# EAGLE design Viisilukk (EAGLE 9.1.3)
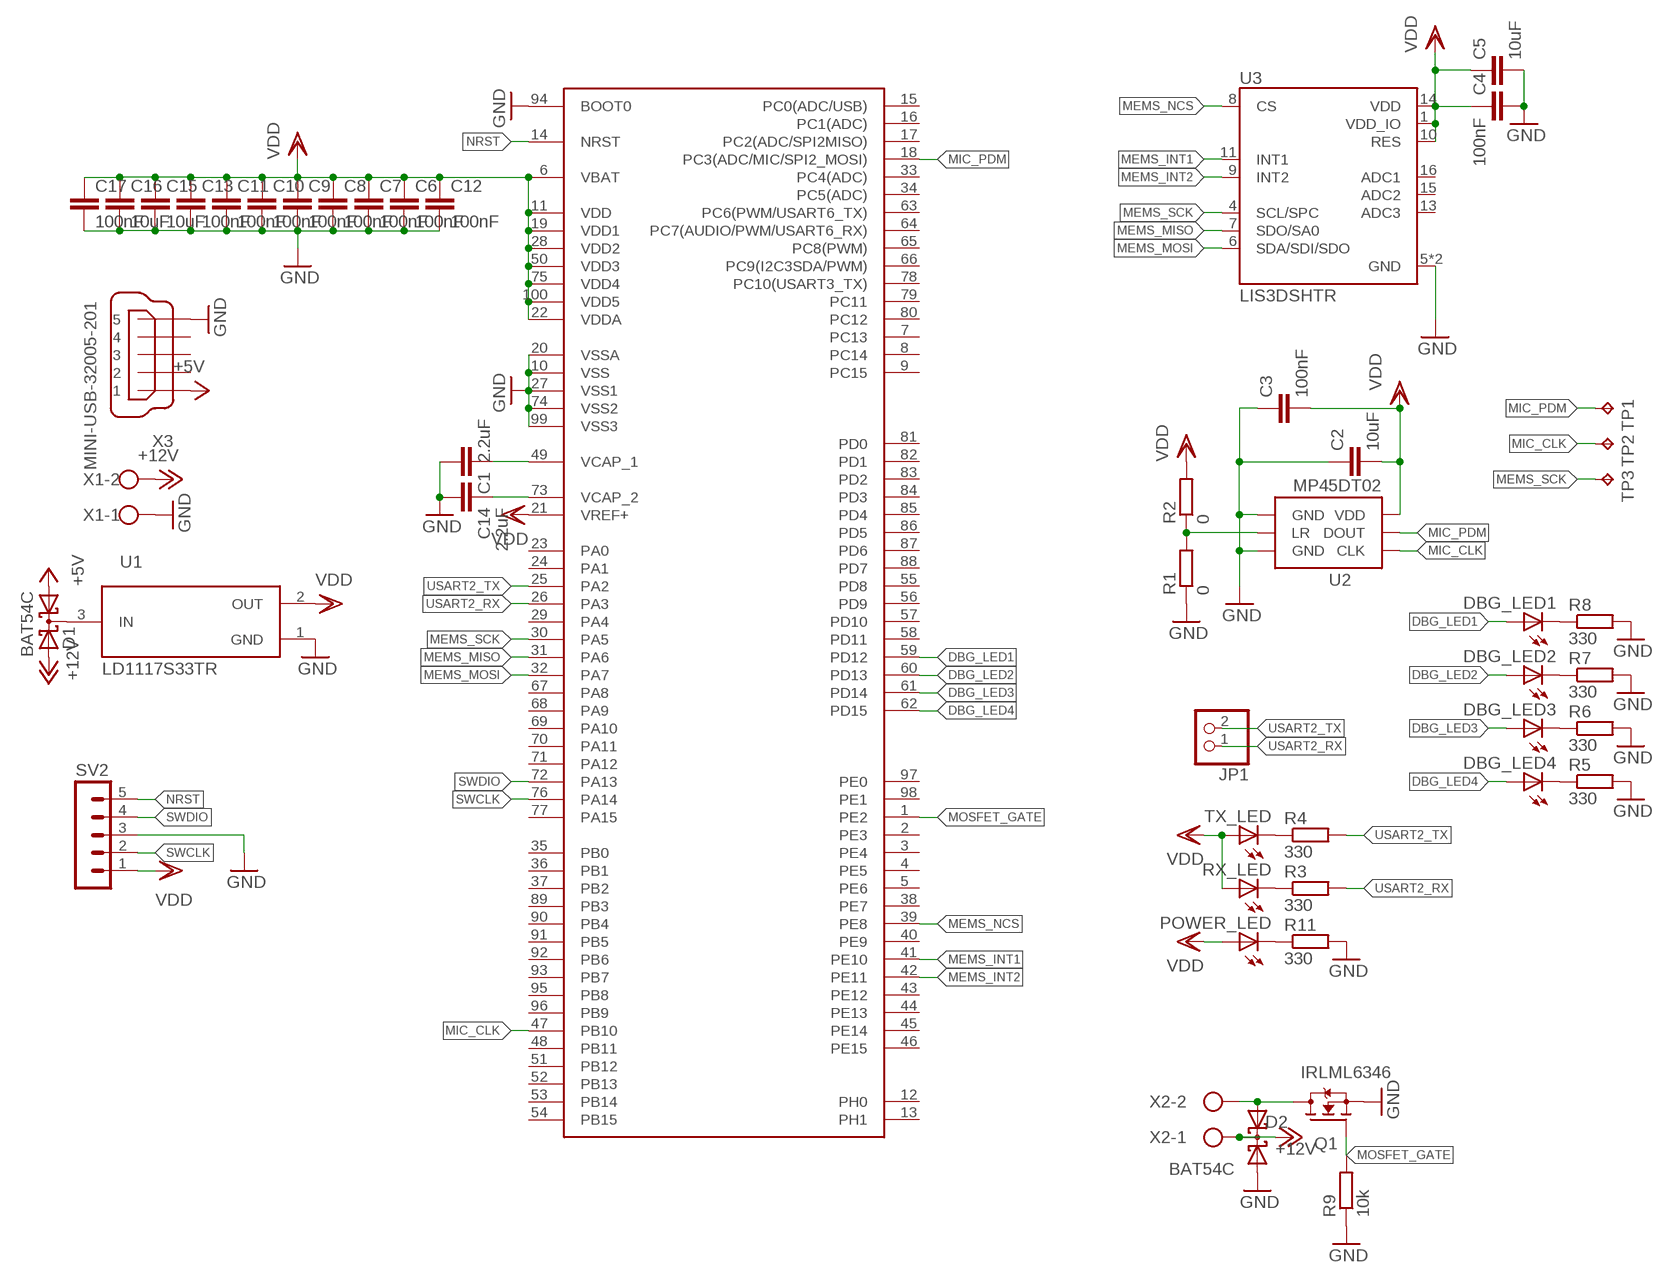
[diagram p0: schematic, sheet 1]

## Parts
C1  2.2uF  C-EUC0603  [C0603]
C2  10uF  C-EUC0805  [C0805]
C3  100nF  C-EUC0603  [C0603]
C4  100nF  C-EUC0603  [C0603]
C5  10uF  C-EUC0805  [C0805]
C6  100nF  C-EUC0603  [C0603]
C7  100nF  C-EUC0603  [C0603]
C8  100nF  C-EUC0603  [C0603]
C9  100nF  C-EUC0603  [C0603]
C10  100nF  C-EUC0603  [C0603]
C11  100nF  C-EUC0603  [C0603]
C12  100nF  C-EUC0603  [C0603]
C13  100nF  C-EUC0603  [C0603]
C14  2.2uF  C-EUC0603  [C0603]
C15  10uF  C-EUC0805  [C0805]
C16  10uF  C-EUC0805  [C0805]
C17  100nF  C-EUC0603  [C0603]
D1  BAT54C  [SOT23]
D2  BAT54C  [SOT23]
DBG_LED1  LEDCHIP-LED0603  [CHIP-LED0603]
DBG_LED2  LEDCHIP-LED0603  [CHIP-LED0603]
DBG_LED3  LEDCHIP-LED0603  [CHIP-LED0603]
DBG_LED4  LEDCHIP-LED0603  [CHIP-LED0603]
JP1  PINHD-1X2  [1X02]
POWER_LED  LEDCHIP-LED0603  [CHIP-LED0603]
Q1  IRLML6346  [SOT23]
R1  0  R-EU_R0603  [R0603]
R2  0  R-EU_R0603  [R0603]
R3  330  R-EU_R0603  [R0603]
R4  330  R-EU_R0603  [R0603]
R5  330  R-EU_R0603  [R0603]
R6  330  R-EU_R0603  [R0603]
R7  330  R-EU_R0603  [R0603]
R8  330  R-EU_R0603  [R0603]
R9  10k  R-EU_R0603  [R0603]
R11  330  R-EU_R0603  [R0603]
RX_LED  LEDCHIP-LED0603  [CHIP-LED0603]
SV2  MA05-1  [MA05-1]
TP1  TPB2,54  [B2,54]
TP2  TPB2,54  [B2,54]
TP3  TPB2,54  [B2,54]
TX_LED  LEDCHIP-LED0603  [CHIP-LED0603]
U1  LD1117S33TR  [SOT230P700X180-4N]
U2  MP45DT02  [ST_HLGA6]
U3  LIS3DSHTR  [LGA16R50P5X3_300X300X100N]
U$1  STM32F407STM32D40X  [LQFP100]
X1  W237-102  [W237-102]
X2  W237-102  [W237-102]
X3  MINI-USB-32005-201  [32005-201]

## Nets
+5V: D1.1(A1) X3.1
+12V: D1.2(A2) D2.3(CC) X1.2 X2.1
DBG_LED1: DBG_LED1.A U$1.59(PD12)
DBG_LED2: DBG_LED2.A U$1.60(PD13)
DBG_LED3: DBG_LED3.A U$1.61(PD14)
DBG_LED4: DBG_LED4.A U$1.62(PD15)
GND: C1.2 C2.1 C3.1 C4.2 C5.2 C6.2 C7.2 C8.2 C9.2 C10.2 C11.2 C12.2 C13.2 C14.2 C15.2 C16.2 C17.2 D2.1(A1) Q1.2(S) R1.1 R5.2 R6.2 R7.2 R8.2 R9.1 R11.2 SV2.3 U1.1(GND) U2.1(GND) U2.3(GND) U3.5(GND) U3.12(GND) U$1.10(VSS) U$1.20(VSSA) U$1.27(VSS1) U$1.74(VSS2) U$1.94(BOOT0) U$1.99(VSS3) X1.1 X3.5
MEMS_INT1: U3.11(INT1) U$1.41(PE10)
MEMS_INT2: U3.9(INT2) U$1.42(PE11)
MEMS_MISO: U3.7(SDO/SA0) U$1.31(PA6)
MEMS_MOSI: U3.6(SDA/SDI/SDO) U$1.32(PA7)
MEMS_NCS: U3.8(CS) U$1.39(PE8)
MEMS_SCK: TP3.TP U3.4(SCL/SPC) U$1.30(PA5)
MIC_CLK: TP2.TP U2.4(CLK) U$1.47(PB10)
MIC_PDM: TP1.TP U2.5(DOUT) U$1.18(PC3(ADC/MIC/SPI2_MOSI))
MOSFET_GATE: Q1.1(G) R9.2 U$1.1(PE2)
N$1: POWER_LED.C R11.1
N$2: C14.1 U$1.73(VCAP_2)
N$3: R1.2 R2.1 U2.2(LR)
N$4: R3.1 RX_LED.C
N$5: C1.1 U$1.49(VCAP_1)
N$6: D1.3(CC) U1.3(IN)
N$7: R4.1 TX_LED.C
N$9: DBG_LED4.C R5.1
N$10: DBG_LED3.C R6.1
N$11: DBG_LED2.C R7.1
N$12: DBG_LED1.C R8.1
N$13: D2.2(A2) Q1.3(D) X2.2
NRST: SV2.5 U$1.14(NRST)
SWCLK: SV2.2 U$1.76(PA14)
SWDIO: SV2.4 U$1.72(PA13)
USART2_RX: JP1.1 R3.2 U$1.26(PA3)
USART2_TX: JP1.2 R4.2 U$1.25(PA2)
VDD: C2.2 C3.2 C4.1 C5.1 C6.1 C7.1 C8.1 C9.1 C10.1 C11.1 C12.1 C13.1 C15.1 C16.1 C17.1 POWER_LED.A R2.2 RX_LED.A SV2.1 TX_LED.A U1.2(OUT) U2.6(VDD) U3.1(VDD_IO) U3.10(RES) U3.14(VDD) U$1.6(VBAT) U$1.11(VDD) U$1.19(VDD1) U$1.21(VREF+) U$1.22(VDDA) U$1.28(VDD2) U$1.50(VDD3) U$1.75(VDD4) U$1.100(VDD5)
Unconnected: U3.13(ADC3) U3.15(ADC2) U3.16(ADC1) U$1.2(PE3) U$1.3(PE4) U$1.4(PE5) U$1.5(PE6) U$1.7(PC13) U$1.8(PC14) U$1.9(PC15) U$1.12(PH0) U$1.13(PH1) U$1.15(PC0(ADC/USB)) U$1.16(PC1(ADC)) U$1.17(PC2(ADC/SPI2MISO)) U$1.23(PA0) U$1.24(PA1) U$1.29(PA4) U$1.33(PC4(ADC)) U$1.34(PC5(ADC)) U$1.35(PB0) U$1.36(PB1) U$1.37(PB2) U$1.38(PE7) U$1.40(PE9) U$1.43(PE12) U$1.44(PE13) U$1.45(PE14) U$1.46(PE15) U$1.48(PB11) U$1.51(PB12) U$1.52(PB13) U$1.53(PB14) U$1.54(PB15) U$1.55(PD8) U$1.56(PD9) U$1.57(PD10) U$1.58(PD11) U$1.63(PC6(PWM/USART6_TX)) U$1.64(PC7(AUDIO/PWM/USART6_RX)) U$1.65(PC8(PWM)) U$1.66(PC9(I2C3SDA/PWM)) U$1.67(PA8) U$1.68(PA9) U$1.69(PA10) U$1.70(PA11) U$1.71(PA12) U$1.77(PA15) U$1.78(PC10(USART3_TX)) U$1.79(PC11) U$1.80(PC12) U$1.81(PD0) U$1.82(PD1) U$1.83(PD2) U$1.84(PD3) U$1.85(PD4) U$1.86(PD5) U$1.87(PD6) U$1.88(PD7) U$1.89(PB3) U$1.90(PB4) U$1.91(PB5) U$1.92(PB6) U$1.93(PB7) U$1.95(PB8) U$1.96(PB9) U$1.97(PE0) U$1.98(PE1) X3.2 X3.3 X3.4

## Library data of the parts
C1-C17 = resistor:C-EU: CAPACITOR, European symbol
D1 D2 = diode:BAT54C: Schottky Diodes Source: Fairchild .. BAT54.pdf
DBG_LED1-DBG_LED4 POWER_LED RX_LED TX_LED = led:LED: LED OSRAM: - CHIPLED LG R971, LG N971, LY N971, LG Q971, LY Q971, LO R971, LY R971 LH N974, LH R974 LS Q976, LO Q976, LY Q976 LO Q996 - Hyper CHIPLED LW Q18S LB Q993, LB Q99A, LB R99A - SideLED LS A670, LO A670, LY A670, LG A670, LP A670 LB A673, LV A673, LT A673, LW A673 LH A674 LY A675 LS A676, LA A676, LO A676, LY A676, LW A676 LS A679, LY A679, LG A679 - Hyper Micro SIDELED® LS Y876, LA Y876, LO Y876, LY Y876 LT Y87S - SmartLED LW L88C, LW L88S LB L89C, LB L89S, LG L890 LS L89K, LO L89K, LY L89K LS L896, LA L896, LO L896, LY L896 - TOPLED LS T670, LO T670, LY T670, LG T670, LP T670 LSG T670, LSP T670, LSY T670, LOP T670, LYG T670 LG T671, LOG T671, LSG T671 LB T673, LV T673, LT T673, LW T673 LH T674 LS T676, LA T676, LO T676, LY T676, LB T676, LH T676, LSB T676, LW T676 LB T67C, LV T67C, LT T67C, LS T67K, LO T67K, LY T67K, LW E67C LS E67B, LA E67B, LO E67B, LY E67B, LB E67C, LV E67C, LT E67C LW T67C LS T679, LY T679, LG T679 LS T770, LO T770, LY T770, LG T770, LP T770 LB T773, LV T773, LT T773, LW T773 LH T774 LS E675, LA E675, LY E675, LS T675 LS T776, LA T776, LO T776, LY T776, LB T776 LHGB T686 LT T68C, LB T68C - Hyper Mini TOPLED® LB M676 - Mini TOPLED Santana® LG M470 LS M47K, LO M47K, LY M47K Source: http://www.osram.convergy.de LUXEON: - LUMILED® LXK2-PW12-R00, LXK2-PW12-S00, LXK2-PW14-U00, LXK2-PW14-V00 LXK2-PM12-R00, LXK2-PM12-S00, LXK2-PM14-U00 LXK2-PE12-Q00, LXK2-PE12-R00, LXK2-PE12-S00, LXK2-PE14-T00, LXK2-PE14-U00 LXK2-PB12-K00, LXK2-PB12-L00, LXK2-PB12-M00, LXK2-PB14-N00, LXK2-PB14-P00, LXK2-PB14-Q00 LXK2-PR12-L00, LXK2-PR12-M00, LXK2-PR14-Q00, LXK2-PR14-R00 LXK2-PD12-Q00, LXK2-PD12-R00, LXK2-PD12-S00 LXK2-PH12-R00, LXK2-PH12-S00 LXK2-PL12-P00, LXK2-PL12-Q00, LXK2-PL12-R00 Source: www.luxeon.com KINGBRIGHT: KA-3528ASYC Source: www.kingbright.com
JP1 = pinhead:PINHD-1X2: PIN HEADER
Q1 = bss138_10:IRLML6346: BSS138 N-Channel Logic Level Enhancement Mode Field Effect Transistor Source: http://www.fairchildsemi.com/datasheets/BS/BSS138.pdf; MF: Fairchild; MPN: BSS138; OC_FARNELL: 9845330; OC_NEWARK: 67R2009
R1-R9 R11 = resistor:R-EU_: RESISTOR, European symbol
SV2 = con-lstb:MA05-1: PIN HEADER; OC_FARNELL: unknown; OC_NEWARK: unknown
TP1-TP3 = testpad:TP: Test pad
U1 = LD1117S33TR:LD1117S33TR: LDO Voltage Regulators 3.3V 0.8A Positive; AVAILABILITY: Unavailable; DESCRIPTION: LD1117 Series 1300 mA 3.3 V Fixed Output Positive Voltage LDO Regulator- SOT-223; MF: STMicroelectronics; MP: LD1117S33TR; PACKAGE: SOT-223 STMicroelectronics; PRICE: None
U2 = MP45DT02:MP45DT02: Digital MEMS microphone; AVAILABILITY: Unavailable; DESCRIPTION: Mic Omni-Directional -26dB 3.6V Rectangular Solder Pad; MF: STMicroelectronics; MP: MP45DT02; PACKAGE: PDIP-18 STMicroelectronics; PRICE: None
U3 = LIS3DSHTR:LIS3DSHTR: MEMS digital output motion sensor ultra low-power high performance 3-axes "nano" accelerometer; AVAILABILITY: Unavailable; DESCRIPTION: MEMS digital output motion sensor: ultra low-power high performance 3-axes nano accelerometer; MF: STMicroelectronics; MP: LIS3DSHTR; PACKAGE: LGA-16 STMicroelectronics; PRICE: None
U$1 = stm32f:STM32F407: Features • Core: ARM 32-bit Cortex™-M4 CPU with FPU, Adaptive real-time accelerator (ART Accelerator™) allowing 0-wait state execution from Flash memory, frequency up to 168 MHz, memory protection unit, 210 DMIPS/ 1.25 DMIPS/MHz (Dhrystone 2.1), and DSP instructions • Memories – Up to 1 Mbyte of Flash memory – Up to 192+4 Kbytes of SRAM including 64- Kbyte of CCM (core coupled memory) data RAM – Flexible static memory controller supporting Compact Flash, SRAM, PSRAM, NOR and NAND memories • LCD parallel interface, 8080/6800 modes • Clock, reset and supply management – 1.8 V to 3.6 V application supply and I/Os – POR, PDR, PVD and BOR – 4-to-26 MHz crystal oscillator – Internal 16 MHz factory-trimmed RC (1% accuracy) – 32 kHz oscillator for RTC with calibration – Internal 32 kHz RC with calibration • Low power – Sleep, Stop and Standby modes – VBAT supply for RTC, 20×32 bit backup registers + optional 4 KB backup SRAM • 3×12-bit, 2.4 MSPS A/D converters: up to 24 channels and 7.2 MSPS in triple interleaved mode • 2×12-bit D/A converters • General-purpose DMA: 16-stream DMA controller with FIFOs and burst support • Up to 17 timers: up to twelve 16-bit and two 32- bit timers up to 168 MHz, each with up to 4 IC/OC/PWM or pulse counter and quadrature (incremental) encoder input • Debug mode – Serial wire debug (SWD) & JTAG interfaces – Cortex-M4 Embedded Trace Macrocell™ • Up to 140 I/O ports with interrupt capability – Up to 136 fast I/Os up to 84 MHz – Up to 138 5 V-tolerant I/Os • Up to 15 communication interfaces – Up to 3 × I2C interfaces (SMBus/PMBus) – Up to 4 USARTs/2 UARTs (10.5 Mbit/s, ISO 7816 interface, LIN, IrDA, modem control) – Up to 3 SPIs (42 Mbits/s), 2 with muxed full-duplex I2S to achieve audio class accuracy via internal audio PLL or external clock – 2 × CAN interfaces (2.0B Active) – SDIO interface • Advanced connectivity – USB 2.0 full-speed device/host/OTG controller with on-chip PHY – USB 2.0 high-speed/full-speed device/host/OTG controller with dedicated DMA, on-chip full-speed PHY and ULPI – 10/100 Ethernet MAC with dedicated DMA: supports IEEE 1588v2 hardware, MII/RMII • 8- to 14-bit parallel camera interface up to 54 Mbytes/s • True random number generator • CRC calculation unit • 96-bit unique ID • RTC: subsecond accuracy, hardware calendar
X1 X2 = con-wago-500:W237-102: WAGO SCREW CLAMP; MPN: 237-102; OC_FARNELL: unknown; OC_NEWARK: 70K9898
X3 = con-cypressindustries:MINI-USB-: MINI USB-B Conector Source: www.cypressindustries.com; OC_FARNELL: unknown; OC_NEWARK: unknown

## Board
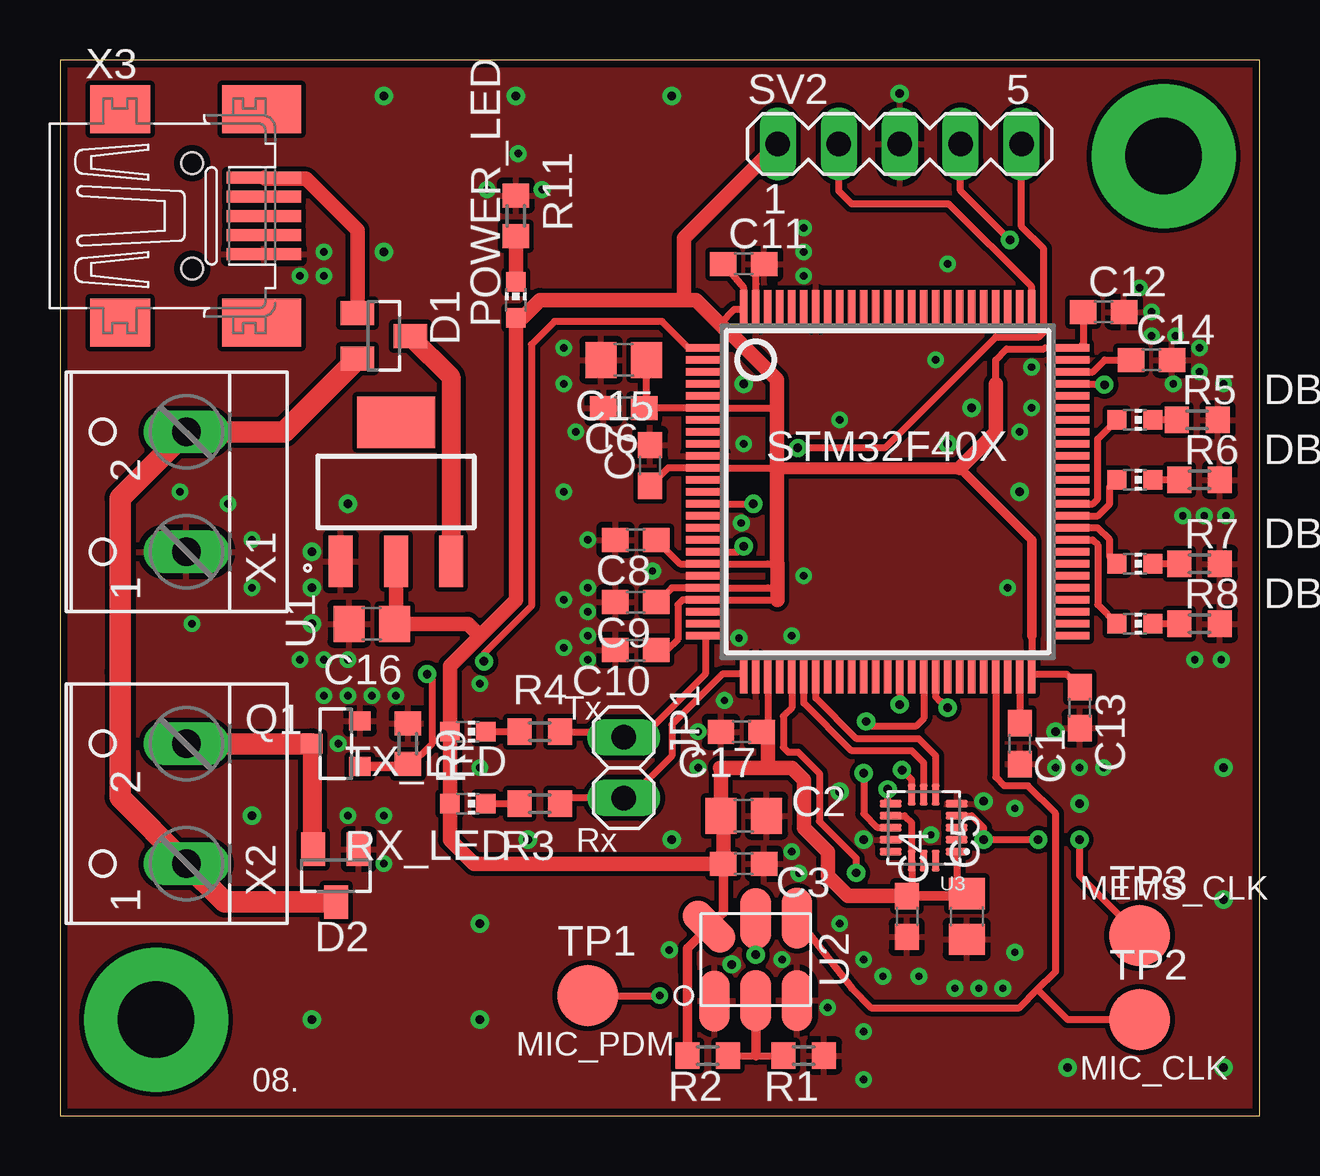
[diagram p1: board, top side]
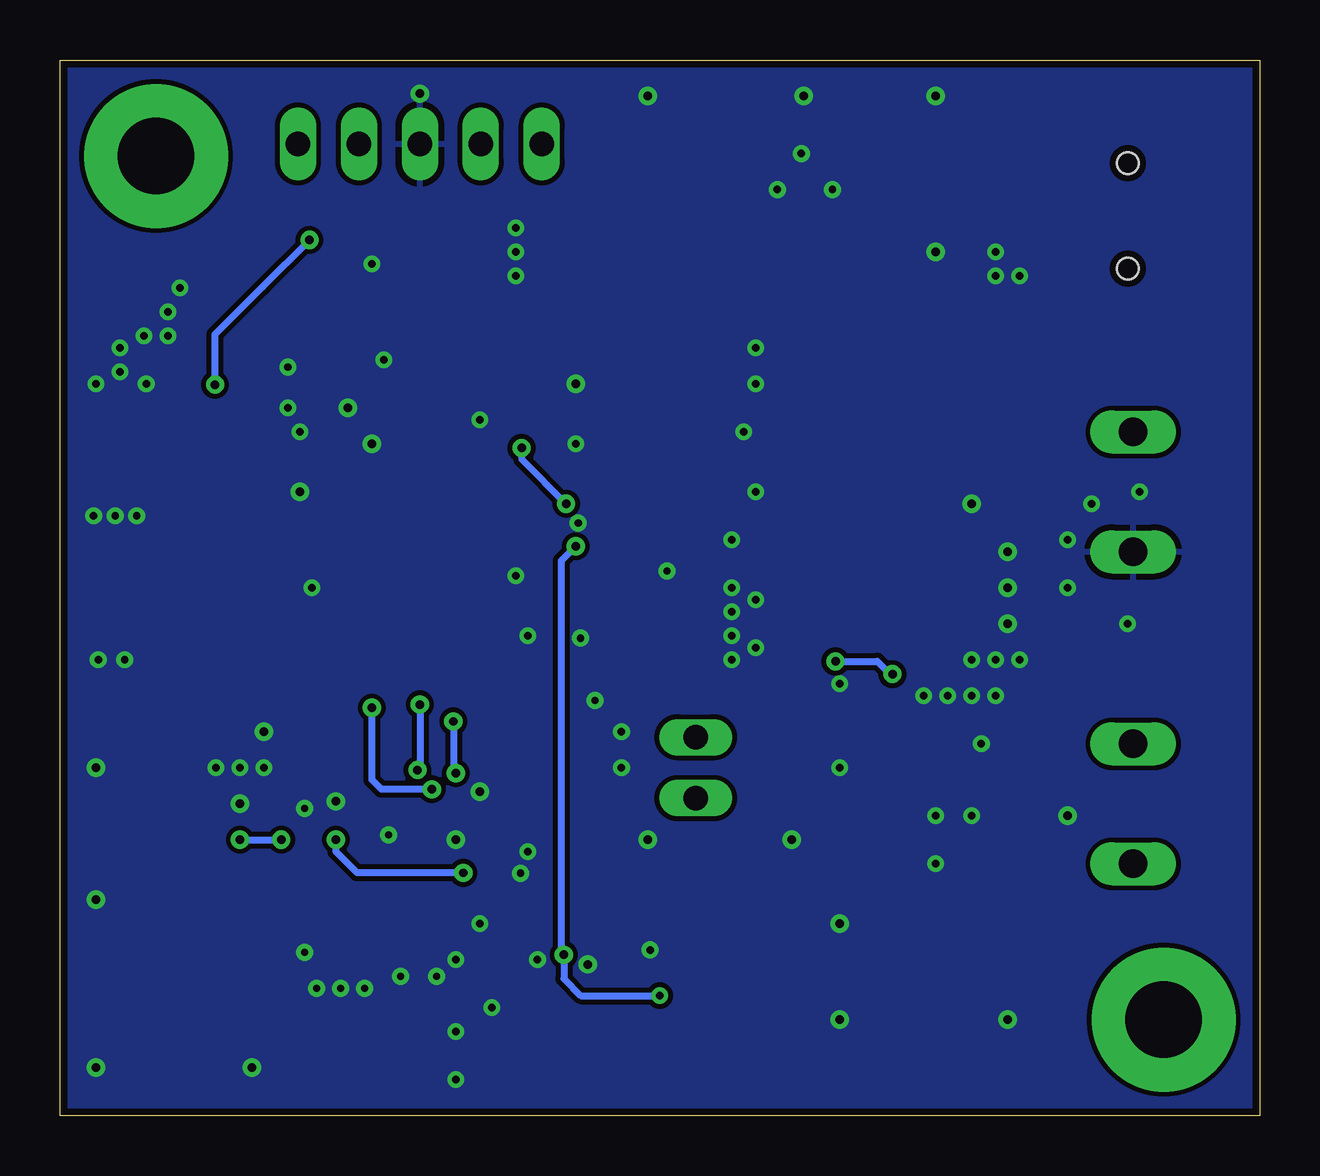
[diagram p2: board, bottom side, seen from below]

Size 50 x 44 mm. Coordinates in mm from the lower left corner, seen from the top.
Outline: 0,0 50,0 50,44 0,44 0,0
Copper layers (1*16): Top 0.035mm / dielectric 1.5mm / Bottom 0.035mm
Design rules "default *": minimum track width 0.2mm, minimum drill 0.3mm, track to track 0.2mm, track to pad 0.2mm, pad to pad 0.2mm, via to via 0.2mm, smd to smd 0mil, copper to edge 0.3mm, drill to drill 6mil, minimum pad ring 10mil, minimum via ring 8mil, stop-mask expansion 4mil, vias tented up to drill 0mil, thermal gap 10mil

### Footprints (pad centres in the part's own frame; a part is rotated, then mirrored left to right if it is on the bottom)
C0603 = smd 1.1 x 1: 1 -0.85,0; 2 0.85,0
C0805 = smd 1.3 x 1.5: 1 -0.95,0; 2 0.95,0
SOT23 = smd 1 x 1.4: 1 -0.95,-1.1; 2 0.95,-1.1; 3 0,1.1
CHIP-LED0603 = smd 0.8 x 0.8: A 0,-0.75; C 0,0.75
1X02 = drill 1.016 long: 1 -1.27,0; 2 1.27,0
SOT23' = smd 0.8 x 0.9: 1 -0.95,-1; 2 0.95,-1; 3 0,1
R0603 = smd 1 x 1.1: 1 -0.85,0; 2 0.85,0
MA05-1 = drill 1.016 long: 1 -5.08,0; 2 -2.54,0; 3 0,0; 4 2.54,0; 5 5.08,0
B2,54 = smd 2.54 x 2.54: TP 0,0
SOT230P700X180-4N = smd 2.15 x 1: 1 -2.9,2.3; 2 -2.9,0; 3 -2.9,-2.3 | smd 2.15 x 3.25: 4 2.9,0
ST_HLGA6 = smd 2.54 x 1.27: 1 -1.727,1.721; 2 -1.708,0; 3 -1.708,-1.727; 4 1.727,-1.721; 5 1.708,0 | smd 2.54 x 1.27 rotated 45: 6 1.373,1.948
LGA16R50P5X3_300X300X100N = smd 0.9 x 0.31: 1 -1.375,1; 2 -1.375,0.5; 3 -1.375,0; 4 -1.375,-0.5; 5 -1.375,-1; 9 1.375,-1; 10 1.375,-0.5; 11 1.375,0; 12 1.375,0.5; 13 1.375,1 | smd 0.31 x 0.9: 6 -0.5,-1.375; 7 0,-1.375; 8 0.5,-1.375; 14 0.5,1.375; 15 0,1.375; 16 -0.5,1.375
LQFP100 = smd 1.6 x 0.3: 1 -7.6,6; 2 -7.6,5.5; 3 -7.6,5; 4 -7.6,4.5; 5 -7.6,4; 6 -7.6,3.5; 7 -7.6,3; 8 -7.6,2.5; 9 -7.6,2; 10 -7.6,1.5; 11 -7.6,1; 12 -7.6,0.5; 13 -7.6,0; 14 -7.6,-0.5; 15 -7.6,-1; 16 -7.6,-1.5; 17 -7.6,-2; 18 -7.6,-2.5; 19 -7.6,-3; 20 -7.6,-3.5; 21 -7.6,-4; 22 -7.6,-4.5; 23 -7.6,-5; 24 -7.6,-5.5; 25 -7.6,-6; 51 7.6,-6; 52 7.6,-5.5; 53 7.6,-5; 54 7.6,-4.5; 55 7.6,-4; 56 7.6,-3.5; 57 7.6,-3; 58 7.6,-2.5; 59 7.6,-2; 60 7.6,-1.5; 61 7.6,-1; 62 7.6,-0.5; 63 7.6,0; 64 7.6,0.5; 65 7.6,1; 66 7.6,1.5; 67 7.6,2; 68 7.6,2.5; 69 7.6,3; 70 7.6,3.5; 71 7.6,4; 72 7.6,4.5; 73 7.6,5; 74 7.6,5.5; 75 7.6,6 | smd 0.3 x 1.6: 26 -6,-7.6; 27 -5.5,-7.6; 28 -5,-7.6; 29 -4.5,-7.6; 30 -4,-7.6; 31 -3.5,-7.6; 32 -3,-7.6; 33 -2.5,-7.6; 34 -2,-7.6; 35 -1.5,-7.6; 36 -1,-7.6; 37 -0.5,-7.6; 38 0,-7.6; 39 0.5,-7.6; 40 1,-7.6; 41 1.5,-7.6; 42 2,-7.6; 43 2.5,-7.6; 44 3,-7.6; 45 3.5,-7.6; 46 4,-7.6; 47 4.5,-7.6; 48 5,-7.6; 49 5.5,-7.6; 50 6,-7.6; 76 6,7.6; 77 5.5,7.6; 78 5,7.6; 79 4.5,7.6; 80 4,7.6; 81 3.5,7.6; 82 3,7.6; 83 2.5,7.6; 84 2,7.6; 85 1.5,7.6; 86 1,7.6; 87 0.5,7.6; 88 0,7.6; 89 -0.5,7.6; 90 -1,7.6; 91 -1.5,7.6; 92 -2,7.6; 93 -2.5,7.6; 94 -3,7.6; 95 -3.5,7.6; 96 -4,7.6; 97 -4.5,7.6; 98 -5,7.6; 99 -5.5,7.6; 100 -6,7.6
W237-102 = drill 1.194 long: 1 -2.5,-1.27; 2 2.5,-1.27
32005-201 = smd 3.1 x 0.5: 1 3,1.6; 2 3,0.8; 3 3,0; 4 3,-0.8; 5 3,-1.6 | smd 2.5 x 2: M1 -3,-4.45; M2 -3,4.45 | smd 3.3 x 2: M3 2.9,4.45; M4 2.9,-4.45 | hole 0.9: 0,2.2; 0,-2.2

### Placement (x,y rotation side)
C1  40,15.5 270 top
C2  28.5,12.5 180 top
C3  28.5,10.5 180 top
C4  35.3,8.3 270 top
C5  37.8,8.3 270 top
C6  23.5,29.5 180 top
C7  24.6,27.1 90 top
C8  24,24 180 top
C9  24,21.4 180 top
C10  24,19.4 180 top
C11  28.5,35.5 0 top
C12  43.5,33.5 0 top
C13  42.5,17 270 top
C14  45.5,31.5 0 top
C15  23.5,31.5 180 top
C16  13,20.5 180 top
C17  28.4,16 180 top
D1  13.5,32.5 270 top
D2  11.5,10 180 top
DBG_LED1  44.8,20.5 270 top
DBG_LED2  44.8,23 270 top
DBG_LED3  44.8,26.5 270 top
DBG_LED4  44.8,29 270 top
JP1  23.5,14.5 90 top
POWER_LED  19,34 0 top
Q1  IRLML6346  [SOT23']  11.5,15.5 90 top
R1  31,2.5 180 top
R2  27,2.5 180 top
R3  20,13 0 top
R4  20,16 0 top
R5  47.4,29 0 top
R6  47.5,26.5 0 top
R7  47.5,23 0 top
R8  47.5,20.5 0 top
R9  14.5,15.5 270 top
R11  19,37.5 90 top
RX_LED  17,13 270 top
SV2  35,40.5 0 top
TP1  22,5 0 top
TP2  45,4 0 top
TP3  45,7.5 0 top
TX_LED  17,16 270 top
U1  14,26 90 top
U2  29,6.5 90 top
U3  36,12 180 top
U$1  34.5,26 0 top
X1  4,26 90 top
X2  4,13 90 top
X3  5.5,37.5 0 top

### Tracks (layer width: path | path; a pad name or v marks a point on that pad's centre or on a via)
+5V
  Top 0.6: X3.1 8.55,39.05 10.26,39.05 12.4,36.91 D1.1
+12V
  Top 0.9: D2.3 6.87,8.9 X2.1 2.5,13.27 2.5,18.5 2.5,25.73 X1.2 9.35,28.5 D1.2
DBG_LED1
  Top 0.3: U$1.59 43.05,24 43.25,23.8 43.25,21.3 DBG_LED1.A
DBG_LED2
  Top 0.3: DBG_LED2.A 43.75,23.3 43.75,24 43.25,24.5 U$1.60
DBG_LED3
  Top 0.3: DBG_LED3.A 43.75,26.2 43.75,25.5 43.25,25 U$1.61
DBG_LED4
  Top 0.3: U$1.62 43.05,25.5 43.25,25.7 43.25,28.2 DBG_LED4.A
GND  (via drill 0.3, 0.35)
  Top 0.3: C11.2 29,35.15 29,34.68 29.02,34.67 29,34.48 U$1.99
  other vias: 11,36 11,35 10,35 10,19 11,19 12,19 14,17.5 13,17.5 12,17.5 11,17.5 11.6,15.5 17.5,18 17.5,14.5 21,19.5 21,26 22,24 24.7,22.7 22,22 22,21 21,21.5 22,20 22,19 28.5,28 25.4,6.9 30.1,6.5 32,4.5 33.5,6.5 33.5,3.5 33.5,1.5 34.3,5.8 35.8,5.8 37.3,5.3 38.3,5.3 39.3,5.3 39.8,6.8 41.5,14.5 42.5,14.5 43.5,14.5 27.7,17.3 26.6,16 26.6,14.5 21,30.5 21,32 21.5,28.5 31,35 31,36 31,37 45,34.5 45.5,33.5 45.5,32.5 46.5,32.5 47.5,32 47.5,31 46.4,30.5 48.4,19 47.3,19 48.6,25 46.8,25 47.7,25 48.5,30.5 12,12.5 13.5,12.5 13.5,10.5 7,25.5 8,24 8,22 5.5,20.5 5,26 17.8,38.6 19.1,40.1 20.1,38.6 36.3,11.7 40.5,31.2 40.5,29.5 40,28.5 39.5,22 28.4,24.7 28.3,19.9 30.5,20 31,22.5 32.5,29 36.5,31.5 39.8,12.8 37,35.5 30.5,11 30.8,10.1 32.5,8 33.5,11.5 38.5,13.1 35,42.6 10.5,22 10.5,23.5 10.5,20.5 41.5,16 42.5,13 10.5,4 17.5,4 42,2 48.5,2 48.5,9 48.5,14.5 25.5,42.5 19,42.5 13.5,42.5 13.5,36 17.5,8 28,6.3 38,29.5 37,28 28.5,30.5 40,26 32.5,13.5 25.5,11.5 19.5,11.5 12,25.5 8,12.5
  pour Top: 0,0 50,0 50,44 0,44
  pour Bottom: 0,44 50,44 50,0 0,0
MEMS_INT1  (via drill 0.35)
  Top 0.3: U$1.41 36,16.55 35.67,16.23 33.8,16.23 v33.6,16.43 | v33.5,14.27 33.5,12.57 34.07,12 U3.11
  Bottom 0.3: v33.6,16.43 33.6,14.37 v33.5,14.27
MEMS_INT2  (via drill 0.35)
  Top 0.3: U3.9 34.5,13.12 v34.5,13.6 | U$1.42 36.5,17.45 36.7,17.25 36.75,17.25 v37,17
  Bottom 0.3: v34.5,13.6 36.6,13.6 37,14 v37,17
MEMS_MISO
  Top 0.3: U3.7 36,14.7 35.5,15.2 32.99,15.2 31,17.19 U$1.31
MEMS_MOSI
  Top 0.3: U3.6 36.5,15 35.8,15.7 33.2,15.7 31.5,17.4 U$1.32
MEMS_NCS  (via drill 0.35)
  Top 0.3: U3.8 35.5,14 v35.1,14.4 | U$1.39 v35,17.13
  Bottom 0.3: v35,17.13 35,14.5 v35.1,14.4
MEMS_SCK  (via drill 0.35)
  Top 0.3: U3.4 38,12.5 38.5,12 v38.5,11.5 v40.77,11.5 | U$1.30 30.5,17 30.15,16.65 30.15,15.35 30.35,15.15 30.77,15.15 31.65,14.27 31.65,12.27 33.19,10.73 v33.19,10.12 | TP3.TP 42.5,10 v42.5,11.5
  Bottom 0.3: v33.19,10.12 37.62,10.12 38.5,11 v38.5,11.5 | v42.5,11.5 v40.77,11.5
MIC_CLK
  Top 0.3: U2.4 33,5.3 33.8,4.5 39.99,4.5 40.75,5.25 | 40.75,5.25 41.5,6.01 41.5,12.59 40.34,13.75 39.35,13.75 39,14.11 U$1.47 | TP2.TP 42,4 40.75,5.25
MIC_PDM  (via drill 0.3, 0.35)
  Top 0.3: U2.5 v29,6.7 | U$1.18 28.27,23.5 v28.5,23.73 | TP1.TP v25,5
  Bottom 0.3: v28.5,23.73 29.1,23.13 29.1,6.8 v29,6.7 29,5.7 28.3,5 v25,5
MOSFET_GATE  (via drill 0.35)
  Top 0.3: 14.5,14.55 14.55,14.5 14.55,14.55 15.5,15.5 15.5,18.2 v15.3,18.4 | v17.67,18.93 17.67,19.25 19.65,21.23 19.65,32.14 20.61,33.1 25.1,33.1 26.2,32 U$1.1
  Top 0.4: Q1.1 14.5,14.55 R9.2
  Bottom 0.3: v15.3,18.4 15.4,18.4 15.93,18.93 v17.67,18.93
N$1
  Top 0.6: POWER_LED.C R11.1
N$2
  Top 0.3: C14.1 43.55,31.5 43.05,31 U$1.73
N$3
  Top 0.3: R2.1 29,2.5 R1.2
  Top 0.4: U2.2 29,3 29,2.5
N$4
  Top 0.3: R3.1 RX_LED.C
N$5
  Top 0.3: U$1.49 C1.1
N$6
  Top 0.8: D1.3 16.3,30.8 U1.3
N$7
  Top 0.3: R4.1 TX_LED.C
N$8  (via drill 3.2 pad 6)
  other vias: 4,4
N$9
  Top 0.3: R5.1 DBG_LED4.C
N$10
  Top 0.3: R6.1 DBG_LED3.C
N$11
  Top 0.3: R7.1 DBG_LED2.C
N$12
  Top 0.3: R8.1 DBG_LED1.C
N$13
  Top 0.8: Q1.3 10.5,11.15 D2.2
  Top 0.9: X2.2 Q1.3
N$14  (via drill 3.2 pad 6)
  other vias: 46,40
NRST  (via drill 0.35)
  Top 0.3: U$1.14 v28.9,25.5 | SV2.5 40.08,37.05 41,36.13 41,32.66 40.8,32.45 39,32.45 34.38,27.83 v30.76,27.83
  Bottom 0.3: v30.76,27.83 30.76,27.36 v28.9,25.5
SWCLK
  Top 0.3: U$1.76 40.5,34.55 37.05,38 33,38 32.46,38.54 SV2.2
SWDIO  (via drill 0.35)
  Top 0.3: v43.54,30.46 arc90 43.5,30.5 U$1.72 | v39.6,36.5 37.54,38.56 SV2.4
  Bottom 0.3: v43.54,30.46 43.54,32.56 41.55,34.55 v39.6,36.5
USART2_RX
  Top 0.3: R3.2 21.08,13.23 JP1.1 23.73,13.23 25.5,15 25.5,16.29 27.61,18.4 U$1.26
USART2_TX
  Top 0.3: R4.2 23.27,16 JP1.2 24.27,15.77 26.9,18.4 U$1.25
VDD
  Top 0.3: 37.8,9.15 C5.1 | C9.1 24.9,21.4 25.5,22 U$1.21 29.5,22 29.9,22 | U$1.28 29.5,16.25 | C11.1 28.5,34.5 U$1.100 28.1,33.6 27.5,33 | 29.9,21.5 U$1.22 25.95,21.5 25.75,21.3 25.75,19.85 25.3,19.4 C10.1 | 29.5,23 29.88,23 | 29.88,27 U$1.11 25.35,27 C7.1 | 29.88,29.5 U$1.6 C6.1 24.45,29.6 C15.1 | C12.1 42.65,32.15 42.5,32 U$1.75 41.05,32 41,31.95 39.45,31.95 39,31.5 39,30.5 | 40.5,20 U$1.50 41.95,18.4 C13.1 | C8.1 25.85,23 U$1.19 29.5,23 | C3.2 | 35.5,9.15 U3.14 35.5,12.2 35.2,12.5 U3.10 | U3.1 37.38,9.53 37,9.15 | 29.5,23 29.9,23
  Top 0.4: C4.1 35.5,9.15 37,9.15 37.8,9.15 | 29.5,16.25 C17.1 | 37.5,27 40.5,24 40.5,20 | 26.15,6.25 26.15,6 | 26.15,6 R2.2 | 26.15,6 26.15,6.58 26.15,6.59 26.15,6.97 U2.6 27.65,8.47 C3.2
  Top 0.5: 29.88,27 37.5,27
  Top 0.6: 26,34 26.5,34 27.5,33 27.85,32.65 27.91,32.65 29.88,30.68 29.88,29.5 29.88,27 29.88,23 | 29.9,21.5 29.9,22 29.9,23 | 29.5,14.5 29,14.5 27.5,14.5 27.55,14.45 C2.2 27.65,12.4 C3.2 17.25,10.5 16.25,11.5 RX_LED.A TX_LED.A 16.25,18.75 17.5,20 | C17.1 29.5,15.75 29.5,14.5 | 26,34 26,36.58 SV2.1 | 17.5,20 19,21.5 19,30 POWER_LED.A 19.25,33.25 20,34 26,34 | U1.2 14,20.55 C16.1 17,20.5 17.5,20 | 29.5,14.5 30.5,14.5 31,14 31,12 32,11 32,10 32.85,9.15 C4.1 | 37.5,27 39,28.5 39,30.5

### Text on the board
tPlace: Tx | Rx | MEMS_CLK | MIC_PDM | MIC_CLK | 08.